# Altium schematic sheet ESP32_main.SchDoc
size A; SheetNumber: 1; SheetTotal: 3
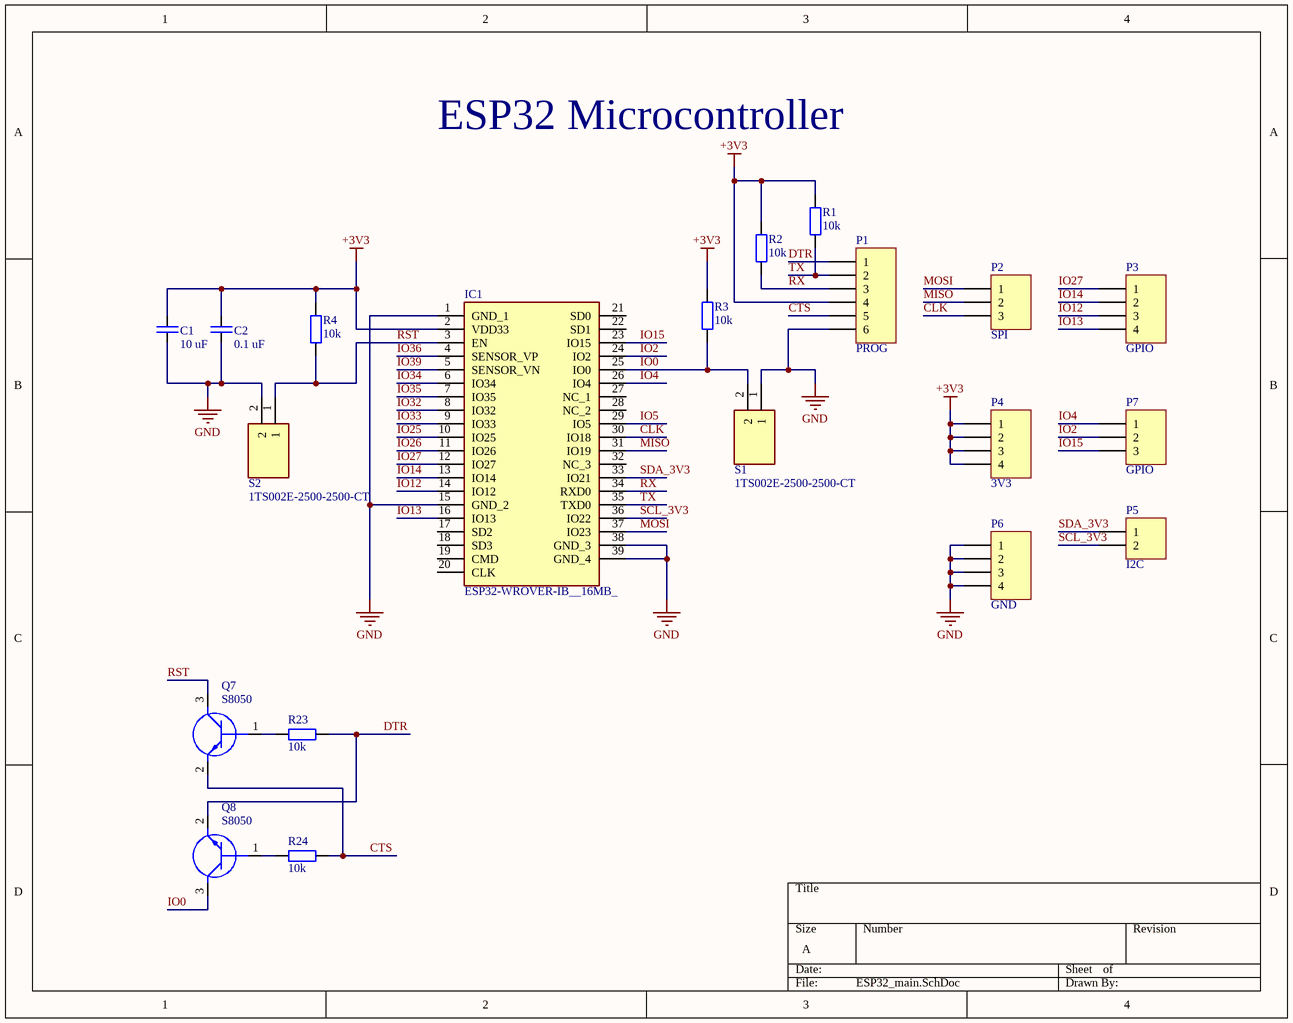
[diagram p0: ESP32_main.SchDoc]

## Parts
C1  10 uF  [C2012_0805I_N]
C2  0.1 uF  [C2012_0805I_N]
IC1  ESP32-WROVER-IB__16MB_  [ESP32WROVERIB16MB]
P1  PROG  [HDR1X6]
P2  SPI  [HDR1X3]
P3  GPIO  [HDR1X4]
P4  3V3  [HDR1X4]
P5  I2C  [HDR1X2]
P6  GND  [HDR1X4]
P7  GPIO  [HDR1X3]
Q7  S8050  [SOT95P240X110-3N]
Q8  S8050  [SOT95P240X110-3N]
R1  10k  [R2012_0805I_N]
R2  10k  [R2012_0805I_N]
R3  10k  [R2012_0805I_N]
R4  10k  [R2012_0805I_N]
R23  10k  [R2012_0805I_N]
R24  10k  [R2012_0805I_N]
S1  1TS002E-2500-2500-CT  [1TS002E25002500CT]
S2  1TS002E-2500-2500-CT  [1TS002E25002500CT]

## Nets
+3V3: C1.1 C2.1 IC1.2(VDD33) P1.4 P4.1 P4.2 P4.3 P4.4 R1.2 R2.2 R3.2 R4.2
GND: C1.2 C2.2 IC1.1(GND_1) IC1.15(GND_2) IC1.38(GND_3) IC1.39(GND_4) P1.6 P6.1 P6.2 P6.3 P6.4 S1.1 S2.2
CLK: IC1.30(IO18) P2.3
CTS: P1.5 Q7.2(E) R24.1
DTR: P1.1 Q8.2(E) R23.1
IO0: IC1.25(IO0) Q8.3(C) R3.1 S1.2
IO2: IC1.24(IO2) P7.2
IO4: IC1.26(IO4) P7.1
IO5: IC1.29(IO5)
IO12: IC1.14(IO12) P3.3
IO13: IC1.16(IO13) P3.4
IO14: IC1.13(IO14) P3.2
IO15: IC1.23(IO15) P7.3
IO25: IC1.10(IO25)
IO26: IC1.11(IO26)
IO27: IC1.12(IO27) P3.1
IO32: IC1.8(IO32)
IO33: IC1.9(IO33)
IO34: IC1.6(IO34)
IO35: IC1.7(IO35)
IO36: IC1.4(SENSOR_VP)
IO39: IC1.5(SENSOR_VN)
MISO: IC1.31(IO19) P2.2
MOSI: IC1.37(IO23) P2.1
RST: IC1.3(EN) Q7.3(C) R4.1 S2.1
RX: IC1.34(RXD0) P1.3 R2.1
SCL_3V3: IC1.36(IO22) P5.2
SDA_3V3: IC1.33(IO21) P5.1
TX: IC1.35(TXD0) P1.2 R1.1
NetQ7_1: Q7.1(B) R23.2
NetQ8_1: Q8.1(B) R24.2

Not connected (* = marked no-connect by the designer): IC1 17(SD2) 18(SD3) 19(CMD) 20(CLK) 21(SD0) 22(SD1) 27(NC_1) 28(NC_2) 32(NC_3)

## Notes on the sheet
- ESP32 Microcontroller

## Library data of the parts
C1 C2 = C: Capacitor
  C1: Value: 10 uF
  C2: Value: 0.1 uF
IC1 = ESP32-WROVER-IB__16MB_: Integrated Circuit; Manufacturer_Name: Espressif Systems; Manufacturer_Part_Number: ESP32-WROVER-IB (16MB); Datasheet Link: https://componentsearchengine.com/Datasheets/1/ESP32-WROVER-IB (16MB).pdf; Height: 3.4mm; Mouser Part Number: 356-ESP32WROIB(16MB); Mouser Price/Stock: https://www.mouser.co.uk/ProductDetail/Espressif-Systems/ESP32-WROVER-IB-16MB?qs=w%2Fv1CP2dgqoY4iJbr7cDFQ%3D%3D
P1 = Header 6: Header, 6-Pin; LatestRevisionDate: 17-Jul-2002; LatestRevisionNote: Re-released for DXP Platform.; Publisher: Altium Limited
P2 P7 = Header 3: Header, 3-Pin; LatestRevisionDate: 17-Jul-2002; LatestRevisionNote: Re-released for DXP Platform.; Publisher: Altium Limited
P3 P4 P6 = Header 4: Header, 4-Pin; LatestRevisionDate: 17-Jul-2002; LatestRevisionNote: Re-released for DXP Platform.; Publisher: Altium Limited
P5 = Header 2: Header, 2-Pin; LatestRevisionDate: 17-Jul-2002; LatestRevisionNote: Re-released for DXP Platform.; Publisher: Altium Limited
Q7 Q8 = S8050: Transistor BJT NPN; Manufacturer_Name: Galaxy; Manufacturer_Part_Number: S8050G; Height: 1.1mm
R1-R4 R23 R24 = R: Value: 10k
S1 S2 = 1TS002E-2500-2500-CT: Switch; Manufacturer_Name: HON YUAN; Datasheet Link: https://datasheet.lcsc.com/szlcsc/HYP-1TS002E-2500-2500_C329185.pdf; Height: 2.7mm; Manufacturer_Part_Number: 1TS002E-2500-2500-CT